# EAGLE design ledmount_11 (EAGLE 4.15)
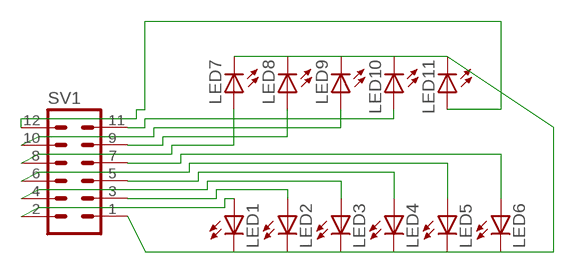
[diagram p0: schematic, sheet 1]

## Parts
LED1  LEDCHIP-LED0805  [CHIP-LED0805]
LED2  LEDCHIP-LED0805  [CHIP-LED0805]
LED3  LEDCHIP-LED0805  [CHIP-LED0805]
LED4  LEDCHIP-LED0805  [CHIP-LED0805]
LED5  LEDCHIP-LED0805  [CHIP-LED0805]
LED6  LEDCHIP-LED0805  [CHIP-LED0805]
LED7  LEDCHIP-LED0805  [CHIP-LED0805]
LED8  LEDCHIP-LED0805  [CHIP-LED0805]
LED9  LEDCHIP-LED0805  [CHIP-LED0805]
LED10  LEDCHIP-LED0805  [CHIP-LED0805]
LED11  LEDCHIP-LED0805  [CHIP-LED0805]
SV1  MA06-2  [MA06-2]

## Nets
N$1: LED1.C LED2.C LED3.C LED4.C LED5.C LED6.C LED7.C LED8.C LED9.C LED10.C LED11.C SV1.1
N$2: LED1.A SV1.2
N$3: LED2.A SV1.3
N$4: LED3.A SV1.4
N$5: LED4.A SV1.5
N$6: LED5.A SV1.6
N$7: LED6.A SV1.7
N$8: LED7.A SV1.8
N$9: LED8.A SV1.9
N$10: LED9.A SV1.10
N$11: LED10.A SV1.11
N$12: LED11.A SV1.12

## Library data of the parts
LED1-LED11 = led:LED: LED OSRAM: - CHIPLED LG R971, LG N971, LY N971, LG Q971, LY Q971, LO R971, LY R971 LH N974, LH R974 LS Q976, LO Q976, LY Q976 LO Q996 - Hyper CHIPLED LW Q18S LB Q993, LB Q99A, LB R99A - SideLED LS A670, LO A670, LY A670, LG A670, LP A670 LB A673, LV A673, LT A673, LW A673 LH A674 LY A675 LS A676, LA A676, LO A676, LY A676, LW A676 LS A679, LY A679, LG A679 - Hyper Micro SIDELED® LS Y876, LA Y876, LO Y876, LY Y876 LT Y87S - SmartLED LW L88C, LW L88S LB L89C, LB L89S, LG L890 LS L89K, LO L89K, LY L89K LS L896, LA L896, LO L896, LY L896 - TOPLED LS T670, LO T670, LY T670, LG T670, LP T670 LSG T670, LSP T670, LSY T670, LOP T670, LYG T670 LG T671, LOG T671, LSG T671 LB T673, LV T673, LT T673, LW T673 LH T674 LS T676, LA T676, LO T676, LY T676, LB T676, LH T676, LSB T676, LW T676 LB T67C, LV T67C, LT T67C, LS T67K, LO T67K, LY T67K, LW E67C LS E67B, LA E67B, LO E67B, LY E67B, LB E67C, LV E67C, LT E67C LW T67C LS T679, LY T679, LG T679 LS T770, LO T770, LY T770, LG T770, LP T770 LB T773, LV T773, LT T773, LW T773 LH T774 LS E675, LA E675, LY E675, LS T675 LS T776, LA T776, LO T776, LY T776, LB T776 LHGB T686 LT T68C, LB T68C - Hyper Mini TOPLED® LB M676 - Mini TOPLED Santana® LG M470 LS M47K, LO M47K, LY M47K Source: http://www.osram.convergy.de/
SV1 = con-lstb:MA06-2: PIN HEADER

## Board
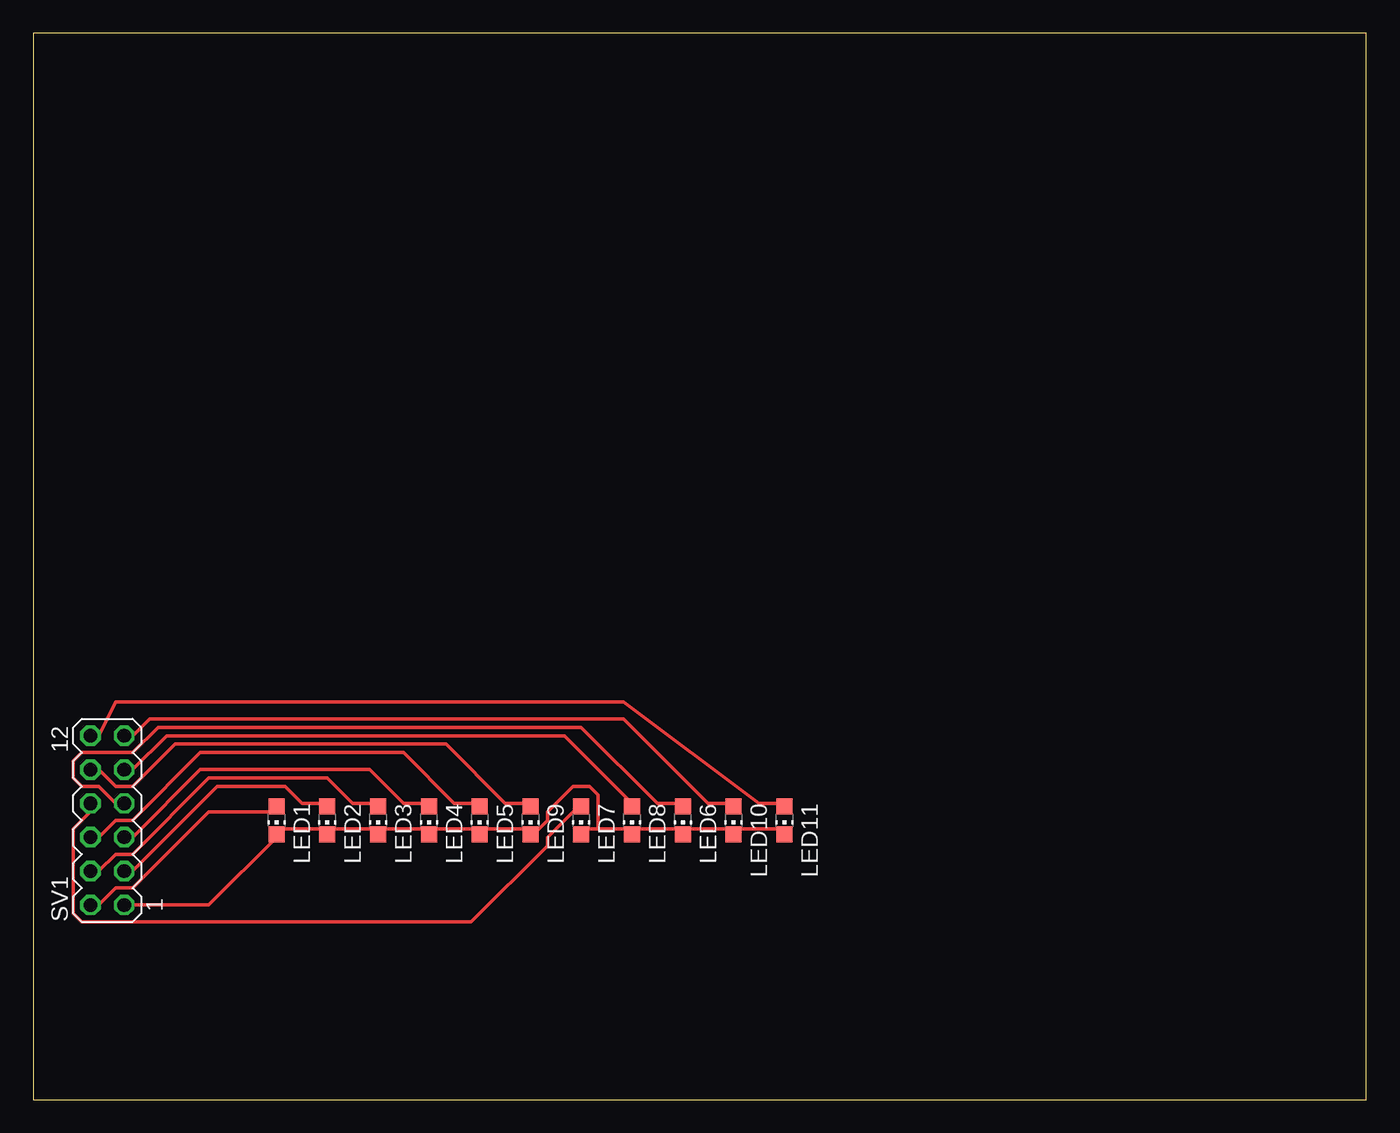
[diagram p1: board, top side]

Size 100 x 80 mm. Coordinates in mm from the lower left corner, seen from the top.
Outline: 0,0 100,0 100,80 0,80 0,0
Copper layers (1*16): Top 0.035mm / dielectric 1.5mm / Bottom 0.035mm
Design rules "default": minimum track width 10mil, minimum drill 24mil, track to track 8mil, track to pad 8mil, pad to pad 8mil, via to via 8mil, smd to smd 8mil, copper to edge 40mil, drill to drill 8mil, minimum pad ring 10mil, minimum via ring 8mil, stop-mask expansion 4mil, vias tented up to drill 0mil, thermal gap 10mil

### Footprints (pad centres in the part's own frame; a part is rotated, then mirrored left to right if it is on the bottom)
CHIP-LED0805 = smd 1.2 x 1.2: A 0,-1.05; C 0,1.05
MA06-2 = drill 1.016 octagon: 1 -6.35,-1.27; 2 -6.35,1.27; 3 -3.81,-1.27; 4 -3.81,1.27; 5 -1.27,-1.27; 6 -1.27,1.27; 7 1.27,-1.27; 8 1.27,1.27; 9 3.81,-1.27; 10 3.81,1.27; 11 6.35,-1.27; 12 6.35,1.27

### Placement (x,y rotation side)
LED1  18.25,20.95 180 top
LED2  22.06,20.95 180 top
LED3  25.87,20.95 180 top
LED4  29.68,20.95 180 top
LED5  33.49,20.95 180 top
LED6  48.73,20.95 180 top
LED7  41.11,20.95 180 top
LED8  44.92,20.95 180 top
LED9  37.3,20.95 180 top
LED10  52.54,20.95 180 top
LED11  56.35,20.95 180 top
SV1  5.55,20.95 90 top

### Tracks (layer width: path | path; a pad name or v marks a point on that pad's centre or on a via)
N$1
  Top 0.254: 42.38,20.31 44.92,20.31 | 42.38,20.31 41.11,20.31 LED7.C | 44.92,20.31 48.73,20.31 | 44.92,20.31 LED8.C | 48.73,20.31 52.54,20.31 | 48.73,20.31 LED6.C | 52.54,20.31 56.35,20.31 LED11.C | 52.54,20.31 LED10.C | 22.06,20.31 18.25,20.31 LED1.C 18.25,19.68 13.17,14.6 SV1.1 | 22.06,20.31 25.87,20.31 | 22.06,20.31 LED2.C | 25.87,20.31 29.68,20.31 | 25.87,20.31 LED3.C | 29.68,20.31 33.49,20.31 | 29.68,20.31 LED4.C | 33.49,20.31 37.3,20.31 LED9.C 37.3,19.68 38.57,20.95 38.57,21.58 40.48,23.49 41.74,23.49 42.38,22.86 42.38,20.31 | 33.49,20.31 LED5.C
N$2
  Top 0.254: LED1.A 18.25,21.58 13.17,21.58 7.46,15.87 6.18,15.87 4.92,14.6 SV1.2
N$3
  Top 0.254: LED2.A 22.06,22.22 20.15,22.22 18.88,23.49 13.81,23.49 7.46,17.14 SV1.3
N$4
  Top 0.254: LED3.A 25.87,22.22 23.96,22.22 22.06,24.12 13.17,24.12 7.46,18.41 6.18,18.41 4.92,17.14 SV1.4
N$5
  Top 0.254: LED4.A 29.68,22.22 27.77,22.22 25.23,24.76 12.54,24.76 7.46,19.68 SV1.5
N$6
  Top 0.254: LED5.A 33.49,22.22 31.58,22.22 27.77,26.03 12.54,26.03 7.46,20.95 6.18,20.95 4.92,19.68 SV1.6
N$7
  Top 0.254: LED6.A 48.73,22.22 46.82,22.22 41.11,27.93 9.36,27.93 7.46,26.03 3.64,26.03 3.01,25.39 3.01,24.12 3.64,23.49 4.92,23.49 6.18,22.22 SV1.7
N$8
  Top 0.254: LED7.A 41.11,21.58 40.48,21.58 38.57,19.68 38.57,19.04 32.85,13.33 3.64,13.33 3.01,13.97 3.01,20.31 4.28,21.58 SV1.8
N$9
  Top 0.254: LED8.A 44.92,22.22 39.84,27.3 10,27.3 7.46,24.76 SV1.9
N$10
  Top 0.254: LED9.A 37.3,22.22 35.39,22.22 30.95,26.66 10.63,26.66 7.46,23.49 6.18,23.49 4.92,24.76 SV1.10
N$11
  Top 0.254: LED10.A 52.54,22.22 50.63,22.22 44.28,28.57 8.73,28.57 7.46,27.3 SV1.11
N$12
  Top 0.254: LED11.A 56.35,22.22 54.45,22.22 44.28,29.84 6.18,29.84 4.92,27.3 SV1.12